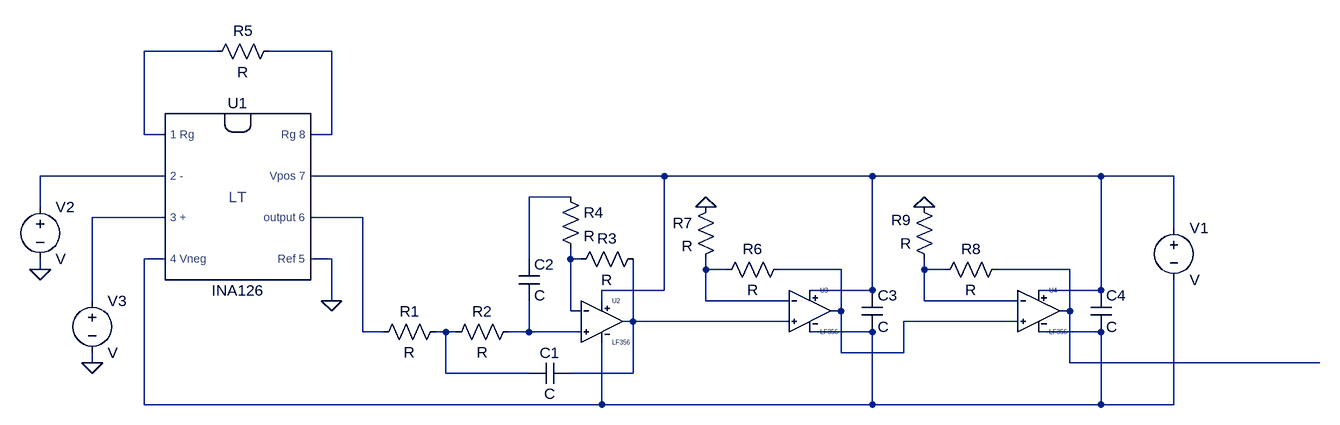
[diagram p0: schematic Amp With Low-Pass Filter.asc]
Amp With Low-Pass Filter.asc, the LTspice schematic file:
Version 4
SHEET 1 1652 680
WIRE -48 -48 -160 -48
WIRE 128 -48 32 -48
WIRE -160 80 -160 -48
WIRE -128 80 -160 80
WIRE 128 80 128 -48
WIRE 128 80 96 80
WIRE -128 144 -320 144
WIRE 640 144 96 144
WIRE 960 144 640 144
WIRE 1312 144 960 144
WIRE 1424 144 1312 144
WIRE 496 176 432 176
WIRE -320 192 -320 144
WIRE -128 208 -240 208
WIRE 176 208 96 208
WIRE 1424 224 1424 144
WIRE -128 272 -160 272
WIRE 128 272 96 272
WIRE 432 272 432 176
WIRE 496 272 496 256
WIRE 512 272 496 272
WIRE -320 288 -320 272
WIRE 704 288 704 272
WIRE 736 288 704 288
WIRE 912 288 816 288
WIRE 1040 288 1040 272
WIRE 1072 288 1040 288
WIRE 1264 288 1152 288
WIRE 640 320 640 144
WIRE 640 320 544 320
WIRE 960 320 960 144
WIRE 960 320 864 320
WIRE 1312 320 1312 144
WIRE 1312 320 1216 320
WIRE -240 336 -240 208
WIRE 128 336 128 272
WIRE 544 336 544 320
WIRE 704 336 704 288
WIRE 832 336 704 336
WIRE 1040 336 1040 288
WIRE 1184 336 1040 336
WIRE 496 352 496 272
WIRE 512 352 496 352
WIRE 912 352 912 288
WIRE 912 352 896 352
WIRE 1264 352 1264 288
WIRE 1264 352 1248 352
WIRE 592 368 592 272
WIRE 592 368 576 368
WIRE 832 368 592 368
WIRE 1184 368 1008 368
WIRE 176 384 176 208
WIRE 208 384 176 384
WIRE 304 384 288 384
WIRE 320 384 304 384
WIRE 432 384 432 336
WIRE 432 384 400 384
WIRE 512 384 432 384
WIRE 960 384 864 384
WIRE 1312 384 1216 384
WIRE 912 416 912 352
WIRE 1008 416 1008 368
WIRE 1008 416 912 416
WIRE -240 432 -240 416
WIRE 1264 432 1264 352
WIRE 1648 432 1264 432
WIRE 304 448 304 384
WIRE 432 448 304 448
WIRE 592 448 592 368
WIRE 592 448 496 448
WIRE -160 496 -160 272
WIRE 544 496 544 400
WIRE 544 496 -160 496
WIRE 960 496 960 384
WIRE 960 496 544 496
WIRE 1312 496 1312 384
WIRE 1312 496 960 496
WIRE 1424 496 1424 304
WIRE 1424 496 1312 496
FLAG 128 336 0
FLAG 704 192 0
FLAG 1040 192 0
FLAG -240 432 0
FLAG -320 288 0
SYMBOL INA126 -16 176 R0
SYMATTR InstName U1
SYMBOL LF356 544 304 R0
SYMATTR InstName U2
SYMBOL LF356 864 288 R0
SYMATTR InstName U3
SYMBOL LF356 1216 288 R0
SYMATTR InstName U4
SYMBOL res 304 368 R90
WINDOW 0 0 56 VBottom 2
WINDOW 3 32 56 VTop 2
SYMATTR InstName R1
SYMBOL res 416 368 R90
WINDOW 0 0 56 VBottom 2
WINDOW 3 32 56 VTop 2
SYMATTR InstName R2
SYMBOL cap 496 432 R90
WINDOW 0 0 32 VBottom 2
WINDOW 3 32 32 VTop 2
SYMATTR InstName C1
SYMBOL cap 416 272 R0
SYMATTR InstName C2
SYMBOL res 608 256 R90
WINDOW 0 0 56 VBottom 2
WINDOW 3 32 56 VTop 2
SYMATTR InstName R3
SYMBOL res 480 160 R0
SYMATTR InstName R4
SYMBOL res 48 -64 R90
WINDOW 0 0 56 VBottom 2
WINDOW 3 32 56 VTop 2
SYMATTR InstName R5
SYMBOL res 832 272 R90
WINDOW 0 0 56 VBottom 2
WINDOW 3 32 56 VTop 2
SYMATTR InstName R6
SYMBOL res 720 176 M0
SYMATTR InstName R7
SYMBOL cap 944 320 R0
SYMATTR InstName C3
SYMBOL res 1168 272 R90
WINDOW 0 0 56 VBottom 2
WINDOW 3 32 56 VTop 2
SYMATTR InstName R8
SYMBOL res 1056 288 R180
WINDOW 0 36 76 Left 2
WINDOW 3 36 40 Left 2
SYMATTR InstName R9
SYMBOL cap 1296 320 R0
SYMATTR InstName C4
SYMBOL voltage 1424 208 R0
SYMATTR InstName V1
SYMBOL voltage -320 176 R0
SYMATTR InstName V2
SYMBOL voltage -240 320 R0
SYMATTR InstName V3

The netlist it stands for:
* Amp With Low-Pass Filter.asc
XU1 N001 N003 N006 N008 0 N007 N004 N002 INA126  ; pins 1_Rg 2_- 3_+ 4_Vneg Ref_5 output_6 Vpos_7 Rg_8
XU2 N016 N009 N004 N008 N014 LF356  ; pins In+ In- V+ V- OUT
XU3 N014 N010 N004 N008 N011 LF356  ; pins In+ In- V+ V- OUT
XU4 N011 N012 N004 N008 N013 LF356  ; pins In+ In- V+ V- OUT
R1 N015 N007 R
R2 N016 N015 R
C1 N014 N015 C
C2 N005 N016 C
R3 N014 N009 R
R4 N005 N009 R
R5 N002 N001 R
R6 N011 N010 R
R7 0 N010 R
C3 N004 N008 C
R8 N013 N012 R
R9 N012 0 R
C4 N004 N008 C
V1 N004 N008 V
V2 N003 0 V
V3 N006 0 V
.lib INA126.sub
.lib LF356.sub
.backanno
.end